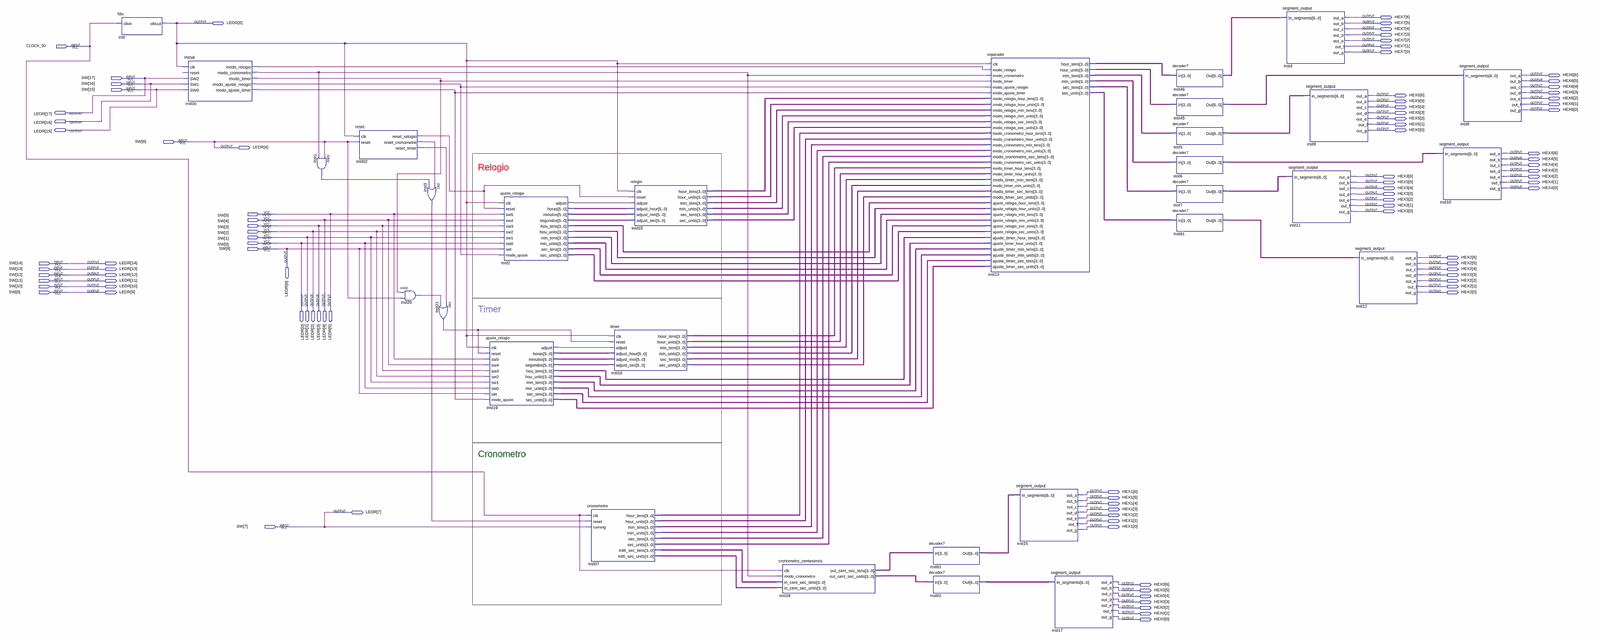
[diagram p0: schematic sheet, whole]
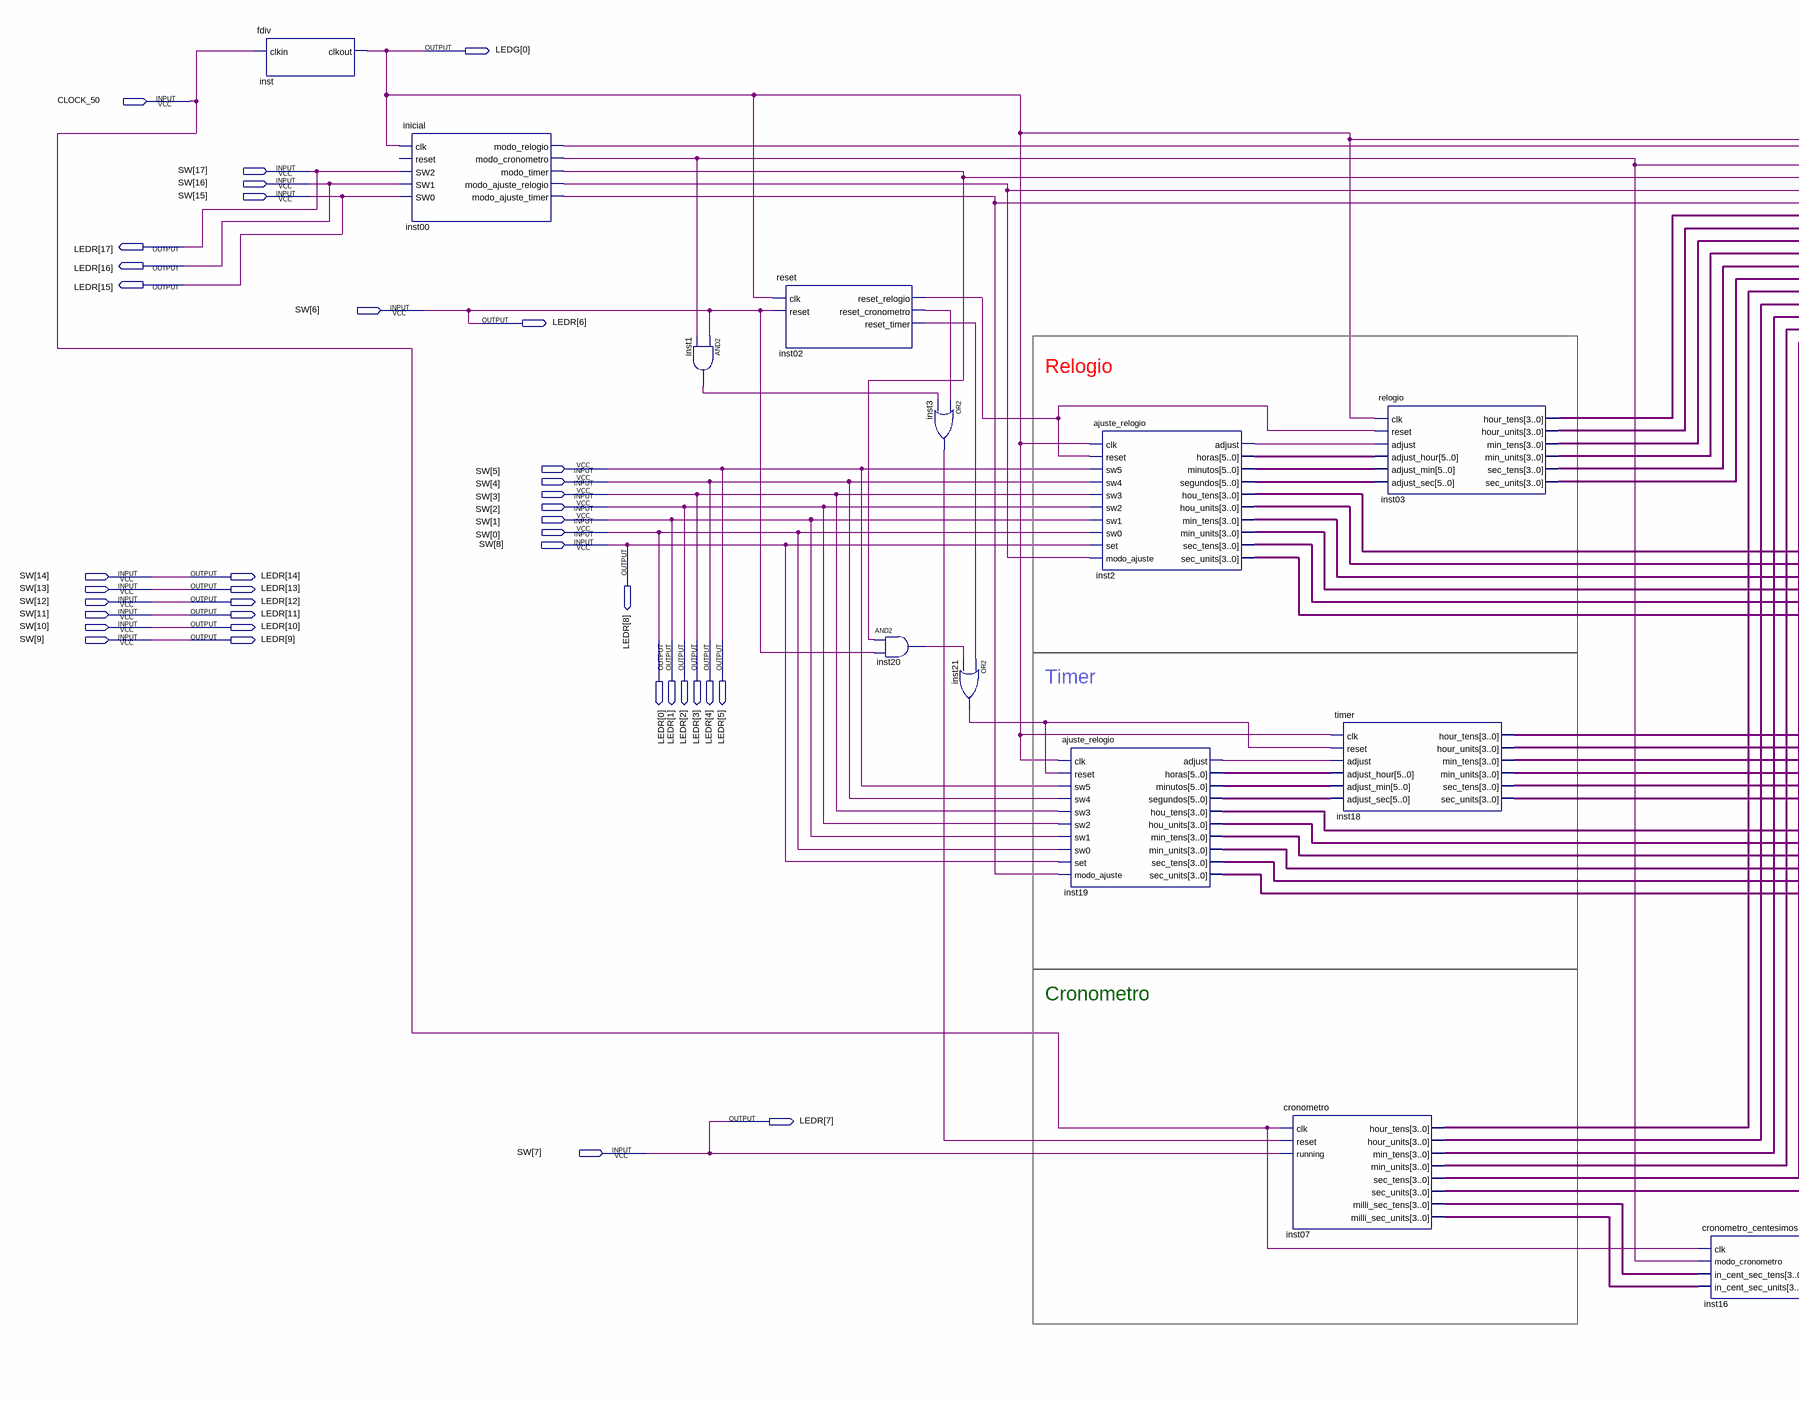
[diagram p1: schematic sheet, left part]
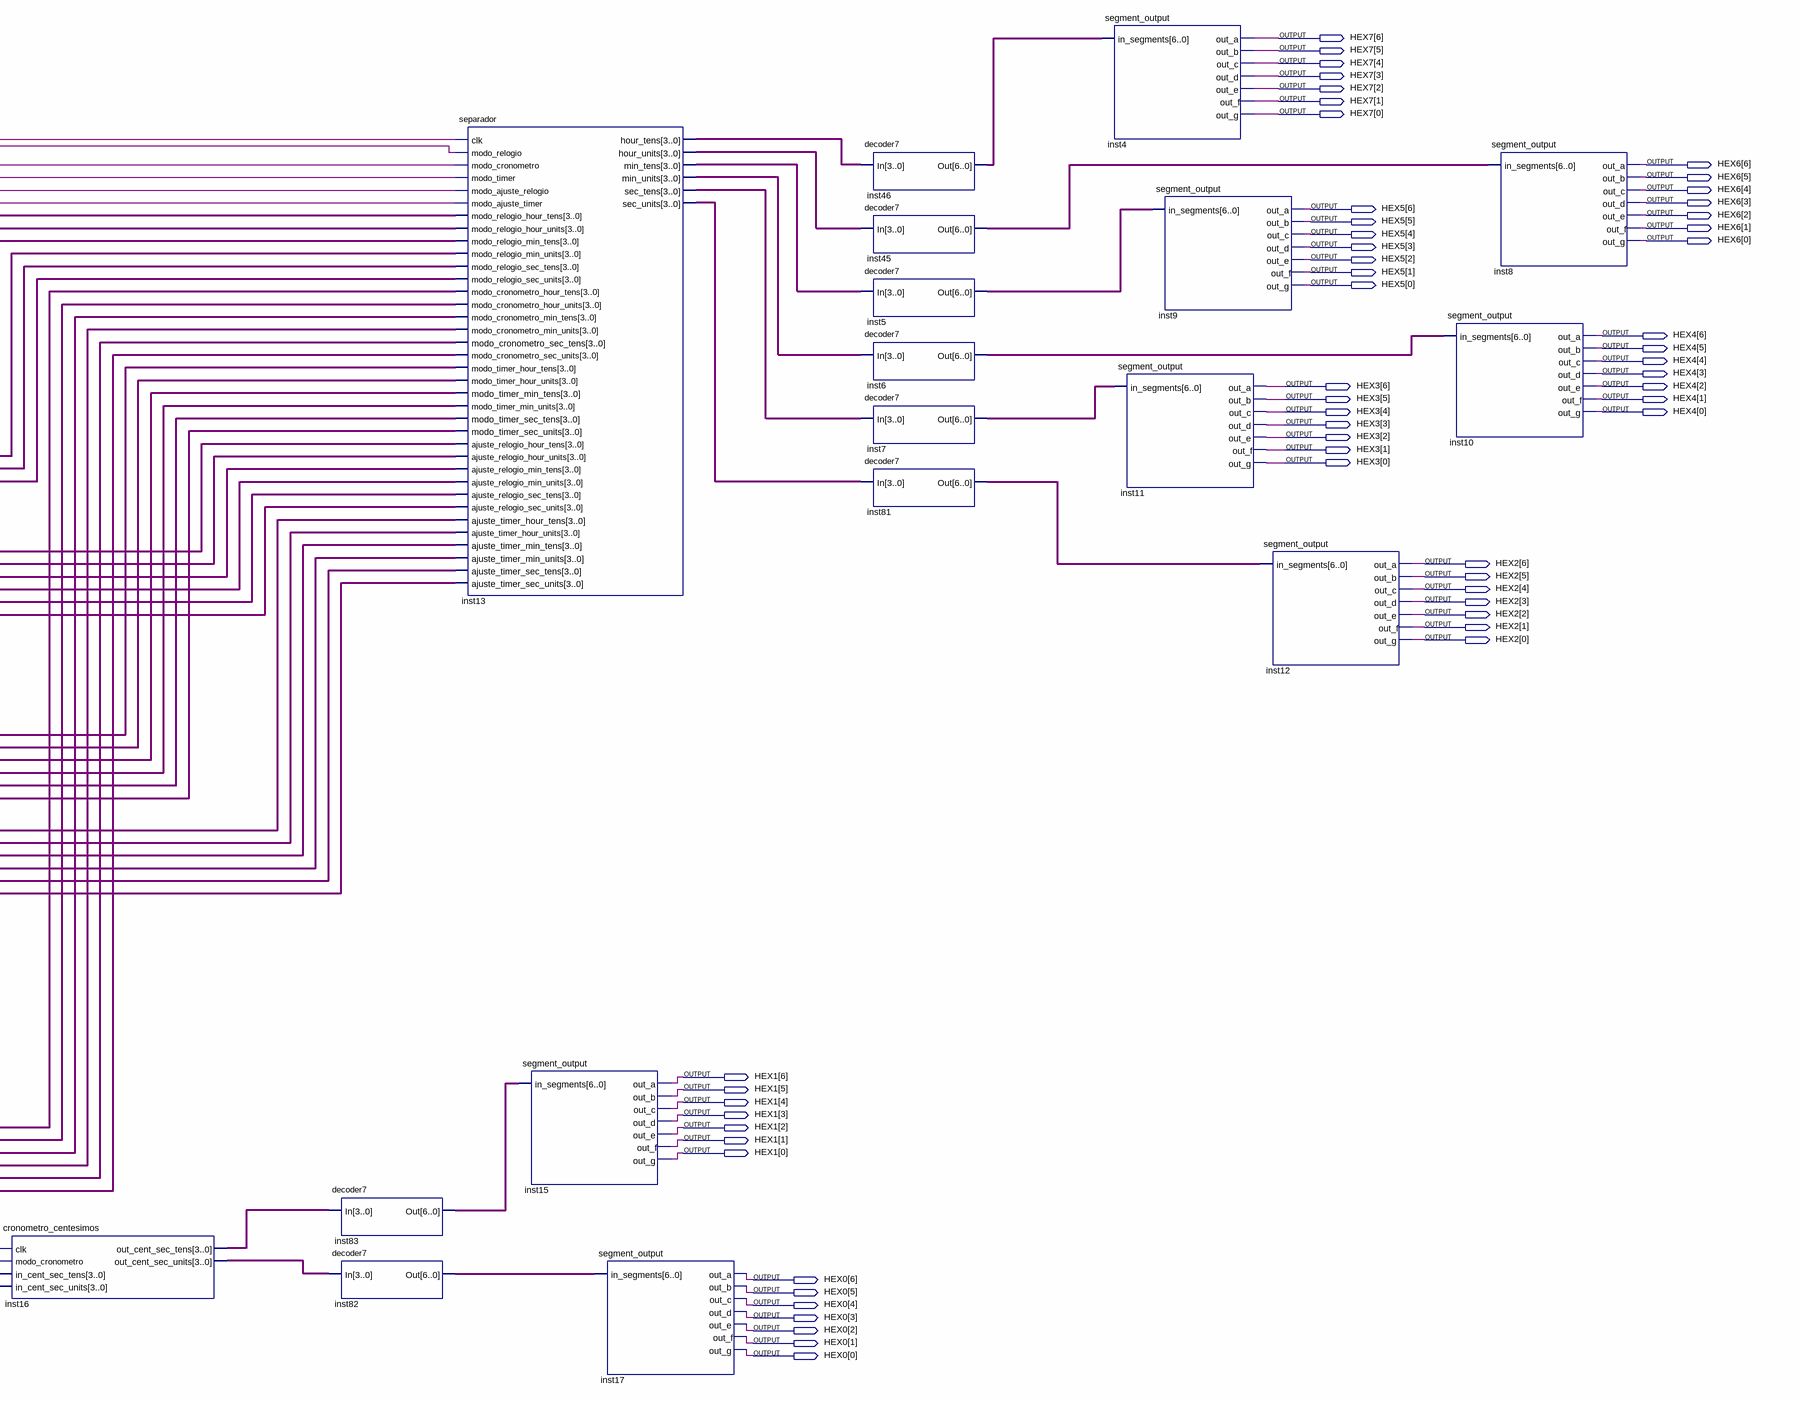
[diagram p2: schematic sheet, right part]
// Quartus schematic Teste.bdf as structural Verilog: 30 symbols, 94 pins
module Teste (
  input  CLOCK_50,
  input  [17:0] SW,
  output [6:0] HEX7,
  output [0:0] LEDG,
  output [6:0] HEX6,
  output [6:0] HEX5,
  output [17:0] LEDR,
  output [6:0] HEX4,
  output [6:0] HEX3,
  output [6:0] HEX2,
  output [6:0] HEX1,
  output [6:0] HEX0
);

  wire inst00_modo_ajuste_relogio, inst00_modo_ajuste_timer, inst00_modo_cronometro, inst00_modo_relogio,
       inst00_modo_timer, inst1_out, inst2_adjust, inst02_reset_cronometro, inst02_reset_relogio,
       inst02_reset_timer, inst3_out, inst19_adjust, inst20_out, inst21_out;
  wire [3:0] inst2_hou_tens, inst2_hou_units, inst2_min_tens, inst2_min_units, inst2_sec_tens,
       inst2_sec_units, inst03_hour_tens, inst03_hour_units, inst03_min_tens, inst03_min_units,
       inst03_sec_tens, inst03_sec_units, inst07_hour_tens, inst07_hour_units, inst07_milli_sec_tens,
       inst07_milli_sec_units, inst07_min_tens, inst07_min_units, inst07_sec_tens, inst07_sec_units,
       inst13_hour_tens, inst13_hour_units, inst13_min_tens, inst13_min_units, inst13_sec_tens,
       inst13_sec_units, inst16_out_cent_sec_tens, inst16_out_cent_sec_units, inst18_hour_tens,
       inst18_hour_units, inst18_min_tens, inst18_min_units, inst18_sec_tens, inst18_sec_units,
       inst19_hou_tens, inst19_hou_units, inst19_min_tens, inst19_min_units, inst19_sec_tens,
       inst19_sec_units;
  wire [5:0] inst2_horas, inst2_minutos, inst2_segundos, inst19_horas, inst19_minutos, inst19_segundos;
  wire [6:0] inst5_out, inst6_out, inst7_out, inst45_out, inst46_out, inst81_out, inst82_out, inst83_out;

  fdiv inst (.clkin(CLOCK_50), .clkout(LEDG[0]));
  inicial inst00 (
    .clk(LEDG[0]), .SW2(SW[17]), .SW1(SW[16]), .SW0(SW[15]), .modo_relogio(inst00_modo_relogio),
    .modo_cronometro(inst00_modo_cronometro), .modo_timer(inst00_modo_timer),
    .modo_ajuste_relogio(inst00_modo_ajuste_relogio), .modo_ajuste_timer(inst00_modo_ajuste_timer));  // open: reset
  and inst1 (inst1_out, SW[6], inst00_modo_cronometro);
  reset inst02 (
    .clk(LEDG[0]), .reset(SW[6]), .reset_relogio(inst02_reset_relogio),
    .reset_cronometro(inst02_reset_cronometro), .reset_timer(inst02_reset_timer));
  and inst20 (inst20_out, inst00_modo_timer, SW[6]);
  or inst3 (inst3_out, inst02_reset_cronometro, inst1_out);
  or inst21 (inst21_out, inst02_reset_timer, inst20_out);
  ajuste_relogio inst19 (
    .clk(LEDG[0]), .reset(inst21_out), .sw5(SW[5]), .sw4(SW[4]), .sw3(SW[3]), .sw2(SW[2]), .sw1(SW[1]),
    .sw0(SW[0]), .set(SW[8]), .modo_ajuste(inst00_modo_ajuste_timer), .adjust(inst19_adjust),
    .horas(inst19_horas), .minutos(inst19_minutos), .segundos(inst19_segundos), .hou_tens(inst19_hou_tens),
    .hou_units(inst19_hou_units), .min_tens(inst19_min_tens), .min_units(inst19_min_units),
    .sec_tens(inst19_sec_tens), .sec_units(inst19_sec_units));
  ajuste_relogio inst2 (
    .clk(LEDG[0]), .reset(inst02_reset_relogio), .sw5(SW[5]), .sw4(SW[4]), .sw3(SW[3]), .sw2(SW[2]),
    .sw1(SW[1]), .sw0(SW[0]), .set(SW[8]), .modo_ajuste(inst00_modo_ajuste_relogio), .adjust(inst2_adjust),
    .horas(inst2_horas), .minutos(inst2_minutos), .segundos(inst2_segundos), .hou_tens(inst2_hou_tens),
    .hou_units(inst2_hou_units), .min_tens(inst2_min_tens), .min_units(inst2_min_units),
    .sec_tens(inst2_sec_tens), .sec_units(inst2_sec_units));
  cronometro inst07 (
    .clk(CLOCK_50), .reset(inst3_out), .running(SW[7]), .hour_tens(inst07_hour_tens),
    .hour_units(inst07_hour_units), .min_tens(inst07_min_tens), .min_units(inst07_min_units),
    .sec_tens(inst07_sec_tens), .sec_units(inst07_sec_units), .milli_sec_tens(inst07_milli_sec_tens),
    .milli_sec_units(inst07_milli_sec_units));
  timer inst18 (
    .clk(LEDG[0]), .reset(inst21_out), .adjust(inst19_adjust), .adjust_hour(inst19_horas),
    .adjust_min(inst19_minutos), .adjust_sec(inst19_segundos), .hour_tens(inst18_hour_tens),
    .hour_units(inst18_hour_units), .min_tens(inst18_min_tens), .min_units(inst18_min_units),
    .sec_tens(inst18_sec_tens), .sec_units(inst18_sec_units));
  relogio inst03 (
    .clk(LEDG[0]), .reset(inst02_reset_relogio), .adjust(inst2_adjust), .adjust_hour(inst2_horas),
    .adjust_min(inst2_minutos), .adjust_sec(inst2_segundos), .hour_tens(inst03_hour_tens),
    .hour_units(inst03_hour_units), .min_tens(inst03_min_tens), .min_units(inst03_min_units),
    .sec_tens(inst03_sec_tens), .sec_units(inst03_sec_units));
  cronometro_centesimos inst16 (
    .clk(CLOCK_50), .modo_cronometro(inst00_modo_cronometro), .in_cent_sec_tens(inst07_milli_sec_tens),
    .in_cent_sec_units(inst07_milli_sec_units), .out_cent_sec_tens(inst16_out_cent_sec_tens),
    .out_cent_sec_units(inst16_out_cent_sec_units));
  decoder7 inst83 (.In(inst16_out_cent_sec_tens), .Out(inst83_out));
  decoder7 inst82 (.In(inst16_out_cent_sec_units), .Out(inst82_out));
  separador inst13 (
    .clk(LEDG[0]), .modo_relogio(inst00_modo_relogio), .modo_cronometro(inst00_modo_cronometro),
    .modo_timer(inst00_modo_timer), .modo_ajuste_relogio(inst00_modo_ajuste_relogio),
    .modo_ajuste_timer(inst00_modo_ajuste_timer), .modo_relogio_hour_tens(inst03_hour_tens),
    .modo_relogio_hour_units(inst03_hour_units), .modo_relogio_min_tens(inst03_min_tens),
    .modo_relogio_min_units(inst03_min_units), .modo_relogio_sec_tens(inst03_sec_tens),
    .modo_relogio_sec_units(inst03_sec_units), .modo_cronometro_hour_tens(inst07_hour_tens),
    .modo_cronometro_hour_units(inst07_hour_units), .modo_cronometro_min_tens(inst07_min_tens),
    .modo_cronometro_min_units(inst07_min_units), .modo_cronometro_sec_tens(inst07_sec_tens),
    .modo_cronometro_sec_units(inst07_sec_units), .modo_timer_hour_tens(inst18_hour_tens),
    .modo_timer_hour_units(inst18_hour_units), .modo_timer_min_tens(inst18_min_tens),
    .modo_timer_min_units(inst18_min_units), .modo_timer_sec_tens(inst18_sec_tens),
    .modo_timer_sec_units(inst18_sec_units), .ajuste_relogio_hour_tens(inst2_hou_tens),
    .ajuste_relogio_hour_units(inst2_hou_units), .ajuste_relogio_min_tens(inst2_min_tens),
    .ajuste_relogio_min_units(inst2_min_units), .ajuste_relogio_sec_tens(inst2_sec_tens),
    .ajuste_relogio_sec_units(inst2_sec_units), .ajuste_timer_hour_tens(inst19_hou_tens),
    .ajuste_timer_hour_units(inst19_hou_units), .ajuste_timer_min_tens(inst19_min_tens),
    .ajuste_timer_min_units(inst19_min_units), .ajuste_timer_sec_tens(inst19_sec_tens),
    .ajuste_timer_sec_units(inst19_sec_units), .hour_tens(inst13_hour_tens), .hour_units(inst13_hour_units),
    .min_tens(inst13_min_tens), .min_units(inst13_min_units), .sec_tens(inst13_sec_tens),
    .sec_units(inst13_sec_units));
  segment_output inst15 (
    .in_segments(inst83_out), .out_a(HEX1[6]), .out_b(HEX1[5]), .out_c(HEX1[4]), .out_d(HEX1[3]),
    .out_e(HEX1[2]), .out_f(HEX1[1]), .out_g(HEX1[0]));
  segment_output inst17 (
    .in_segments(inst82_out), .out_a(HEX0[6]), .out_b(HEX0[5]), .out_c(HEX0[4]), .out_d(HEX0[3]),
    .out_e(HEX0[2]), .out_f(HEX0[1]), .out_g(HEX0[0]));
  decoder7 inst46 (.In(inst13_hour_tens), .Out(inst46_out));
  decoder7 inst45 (.In(inst13_hour_units), .Out(inst45_out));
  decoder7 inst5 (.In(inst13_min_tens), .Out(inst5_out));
  decoder7 inst6 (.In(inst13_min_units), .Out(inst6_out));
  decoder7 inst7 (.In(inst13_sec_tens), .Out(inst7_out));
  decoder7 inst81 (.In(inst13_sec_units), .Out(inst81_out));
  segment_output inst4 (
    .in_segments(inst46_out), .out_a(HEX7[6]), .out_b(HEX7[5]), .out_c(HEX7[4]), .out_d(HEX7[3]),
    .out_e(HEX7[2]), .out_f(HEX7[1]), .out_g(HEX7[0]));
  segment_output inst11 (
    .in_segments(inst7_out), .out_a(HEX3[6]), .out_b(HEX3[5]), .out_c(HEX3[4]), .out_d(HEX3[3]),
    .out_e(HEX3[2]), .out_f(HEX3[1]), .out_g(HEX3[0]));
  segment_output inst9 (
    .in_segments(inst5_out), .out_a(HEX5[6]), .out_b(HEX5[5]), .out_c(HEX5[4]), .out_d(HEX5[3]),
    .out_e(HEX5[2]), .out_f(HEX5[1]), .out_g(HEX5[0]));
  segment_output inst12 (
    .in_segments(inst81_out), .out_a(HEX2[6]), .out_b(HEX2[5]), .out_c(HEX2[4]), .out_d(HEX2[3]),
    .out_e(HEX2[2]), .out_f(HEX2[1]), .out_g(HEX2[0]));
  segment_output inst8 (
    .in_segments(inst45_out), .out_a(HEX6[6]), .out_b(HEX6[5]), .out_c(HEX6[4]), .out_d(HEX6[3]),
    .out_e(HEX6[2]), .out_f(HEX6[1]), .out_g(HEX6[0]));
  segment_output inst10 (
    .in_segments(inst6_out), .out_a(HEX4[6]), .out_b(HEX4[5]), .out_c(HEX4[4]), .out_d(HEX4[3]),
    .out_e(HEX4[2]), .out_f(HEX4[1]), .out_g(HEX4[0]));

  assign LEDR = SW;

  // Notes on the sheet:
  //   Relogio
  //   Timer
  //   Cronometro
endmodule
